# Altium schematic sheet JP-LED.SchDoc
size A4
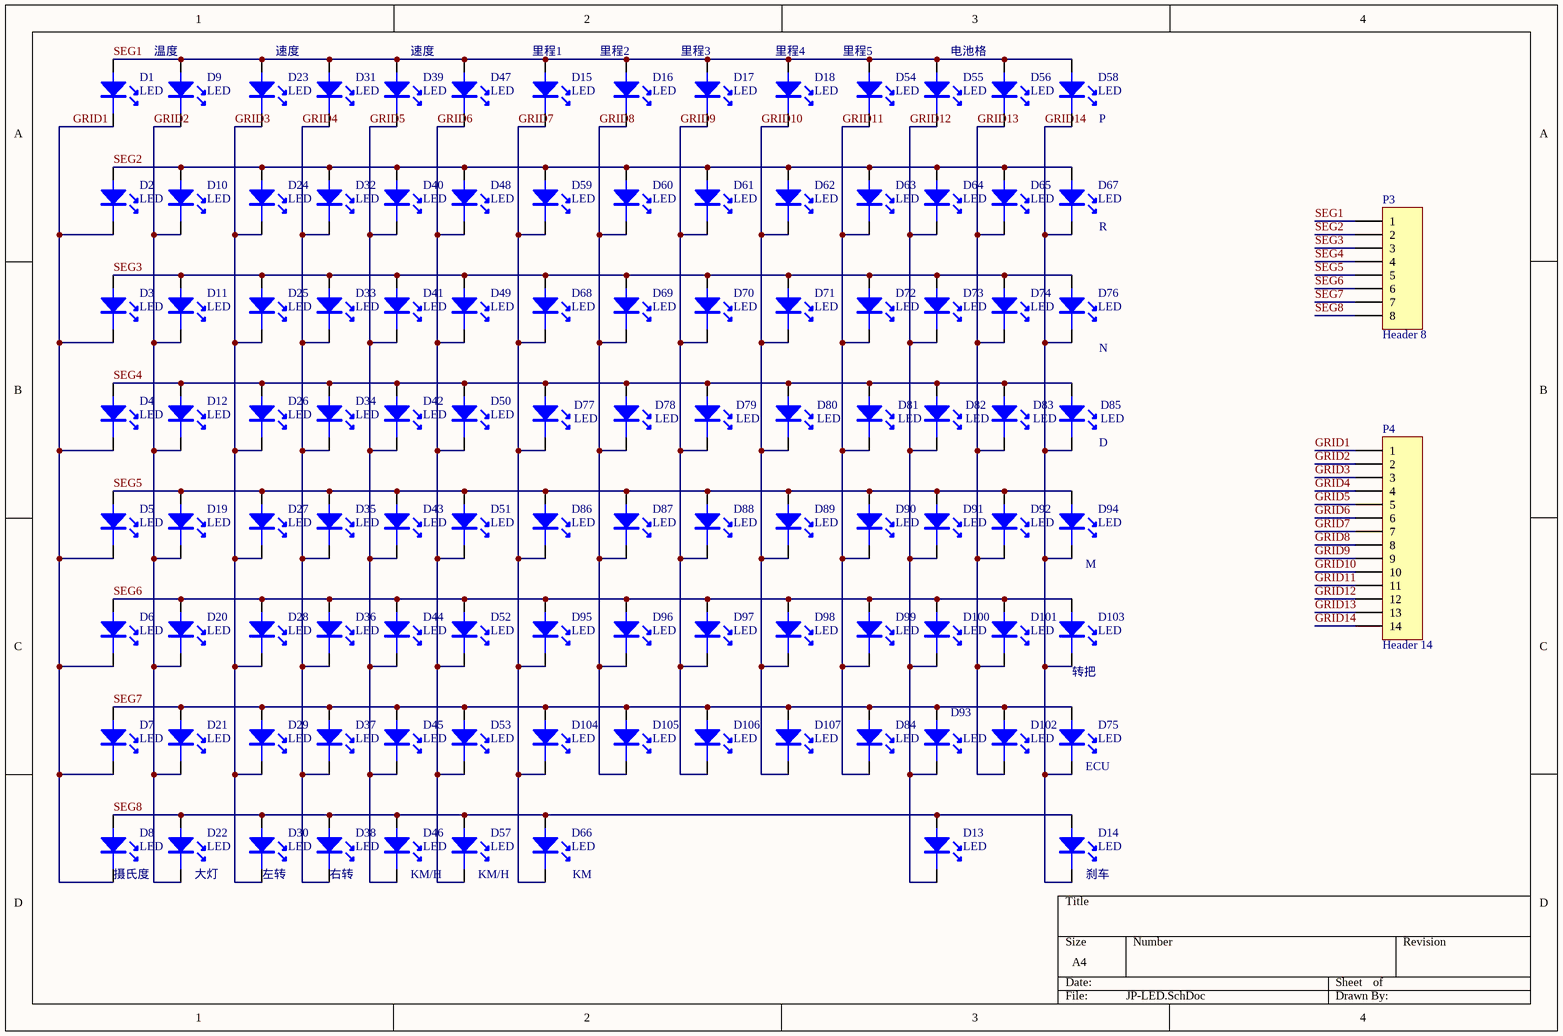
[diagram p0: JP-LED.SchDoc]

## Parts
D1  LED  [0603-LED]
D2  LED  [0603-LED]
D3  LED  [0603-LED]
D4  LED  [0603-LED]
D5  LED  [0603-LED]
D6  LED  [0603-LED]
D7  LED  [0603-LED]
D8  LED  [0603-LED]
D9  LED  [0603-LED]
D10  LED  [0603-LED]
D11  LED  [0603-LED]
D12  LED  [0603-LED]
D13  LED  [0603-LED]
D14  LED  [0603-LED]
D15  LED  [0603-LED]
D16  LED  [0603-LED]
D17  LED  [0603-LED]
D18  LED  [0603-LED]
D19  LED  [0603-LED]
D20  LED  [0603-LED]
D21  LED  [0603-LED]
D22  LED  [0603-LED]
D23  LED  [0603-LED]
D24  LED  [0603-LED]
D25  LED  [0603-LED]
D26  LED  [0603-LED]
D27  LED  [0603-LED]
D28  LED  [0603-LED]
D29  LED  [0603-LED]
D30  LED  [0603-LED]
D31  LED  [0603-LED]
D32  LED  [0603-LED]
D33  LED  [0603-LED]
D34  LED  [0603-LED]
D35  LED  [0603-LED]
D36  LED  [0603-LED]
D37  LED  [0603-LED]
D38  LED  [0603-LED]
D39  LED  [0603-LED]
D40  LED  [0603-LED]
D41  LED  [0603-LED]
D42  LED  [0603-LED]
D43  LED  [0603-LED]
D44  LED  [0603-LED]
D45  LED  [0603-LED]
D46  LED  [0603-LED]
D47  LED  [0603-LED]
D48  LED  [0603-LED]
D49  LED  [0603-LED]
D50  LED  [0603-LED]
D51  LED  [0603-LED]
D52  LED  [0603-LED]
D53  LED  [0603-LED]
D54  LED  [0603-LED]
D55  LED  [0603-LED]
D56  LED  [0603-LED]
D57  LED  [0603-LED]
D58  LED  [0603-LED]
D59  LED  [0603-LED]
D60  LED  [0603-LED]
D61  LED  [0603-LED]
D62  LED  [0603-LED]
D63  LED  [0603-LED]
D64  LED  [0603-LED]
D65  LED  [0603-LED]
D66  LED  [0603-LED]
D67  LED  [0603-LED]
D68  LED  [0603-LED]
D69  LED  [0603-LED]
D70  LED  [0603-LED]
D71  LED  [0603-LED]
D72  LED  [0603-LED]
D73  LED  [0603-LED]
D74  LED  [0603-LED]
D75  LED  [0603-LED]
D76  LED  [0603-LED]
D77  LED  [0603-LED]
D78  LED  [0603-LED]
D79  LED  [0603-LED]
D80  LED  [0603-LED]
D81  LED  [0603-LED]
D82  LED  [0603-LED]
D83  LED  [0603-LED]
D84  LED  [0603-LED]
D85  LED  [0603-LED]
D86  LED  [0603-LED]
D87  LED  [0603-LED]
D88  LED  [0603-LED]
D89  LED  [0603-LED]
D90  LED  [0603-LED]
D91  LED  [0603-LED]
D92  LED  [0603-LED]
D93  LED  [0603-LED]
D94  LED  [0603-LED]
D95  LED  [0603-LED]
D96  LED  [0603-LED]
D97  LED  [0603-LED]
D98  LED  [0603-LED]
D99  LED  [0603-LED]
D100  LED  [0603-LED]
D101  LED  [0603-LED]
D102  LED  [0603-LED]
D103  LED  [0603-LED]
D104  LED  [0603-LED]
D105  LED  [0603-LED]
D106  LED  [0603-LED]
D107  LED  [0603-LED]
P3  Header 8  [HDR1X8]
P4  Header 14  [SIP14]

## Nets
GRID1: D1.2 D2.2 D3.2 D4.2 D5.2 D6.2 D7.2 D8.2 P4.1
GRID2: D9.2 D10.2 D11.2 D12.2 D19.2 D20.2 D21.2 D22.2 P4.2
GRID3: D23.2 D24.2 D25.2 D26.2 D27.2 D28.2 D29.2 D30.2 P4.3
GRID4: D31.2 D32.2 D33.2 D34.2 D35.2 D36.2 D37.2 D38.2 P4.4
GRID5: D39.2 D40.2 D41.2 D42.2 D43.2 D44.2 D45.2 D46.2 P4.5
GRID6: D47.2 D48.2 D49.2 D50.2 D51.2 D52.2 D53.2 D57.2 P4.6
GRID7: D15.2 D59.2 D66.2 D68.2 D77.2 D86.2 D95.2 D104.2 P4.7
GRID8: D16.2 D60.2 D69.2 D78.2 D87.2 D96.2 D105.2 P4.8
GRID9: D17.2 D61.2 D70.2 D79.2 D88.2 D97.2 D106.2 P4.9
GRID10: D18.2 D62.2 D71.2 D80.2 D89.2 D98.2 D107.2 P4.10
GRID11: D54.2 D63.2 D72.2 D81.2 D84.2 D90.2 D99.2 P4.11
GRID12: D13.2 D55.2 D64.2 D73.2 D82.2 D91.2 D93.2 D100.2 P4.12
GRID13: D56.2 D65.2 D74.2 D83.2 D92.2 D101.2 D102.2 P4.13
GRID14: D14.2 D58.2 D67.2 D75.2 D76.2 D85.2 D94.2 D103.2 P4.14
SEG1: D1.1 D9.1 D15.1 D16.1 D17.1 D18.1 D23.1 D31.1 D39.1 D47.1 D54.1 D55.1 D56.1 D58.1 P3.1
SEG2: D2.1 D10.1 D24.1 D32.1 D40.1 D48.1 D59.1 D60.1 D61.1 D62.1 D63.1 D64.1 D65.1 D67.1 P3.2
SEG3: D3.1 D11.1 D25.1 D33.1 D41.1 D49.1 D68.1 D69.1 D70.1 D71.1 D72.1 D73.1 D74.1 D76.1 P3.3
SEG4: D4.1 D12.1 D26.1 D34.1 D42.1 D50.1 D77.1 D78.1 D79.1 D80.1 D81.1 D82.1 D83.1 D85.1 P3.4
SEG5: D5.1 D19.1 D27.1 D35.1 D43.1 D51.1 D86.1 D87.1 D88.1 D89.1 D90.1 D91.1 D92.1 D94.1 P3.5
SEG6: D6.1 D20.1 D28.1 D36.1 D44.1 D52.1 D95.1 D96.1 D97.1 D98.1 D99.1 D100.1 D101.1 D103.1 P3.6
SEG7: D7.1 D21.1 D29.1 D37.1 D45.1 D53.1 D75.1 D84.1 D93.1 D102.1 D104.1 D105.1 D106.1 D107.1 P3.7
SEG8: D8.1 D13.1 D14.1 D22.1 D30.1 D38.1 D46.1 D57.1 D66.1 P3.8

## Notes on the sheet
- (near D9) 温度
- (near D23) 速度
- (near D39) 速度
- (near D15) 里程1
- (near D16) 里程2
- (near D17) 里程3
- (near D18) 里程4
- (near D54) 里程5
- (near D55) 电池格
- (near D58) P
- (near D67) R
- N
- (near D85) D
- (near D94) M
- (near D103) 转把
- (near D75) ECU
- (near D8) 摄氏度
- (near D22) 大灯
- (near D30) 左转
- (near D38) 右转
- (near D46) KM/H
- (near D57) KM/H
- (near D66) KM
- (near D14) 刹车

## Library data of the parts
P3 = Header 8: Header, 8-Pin; LatestRevisionDate: 17-Jul-2002; LatestRevisionNote: Re-released for DXP Platform.; Publisher: Altium Limited
P4 = Header 14: Header, 14-Pin; LatestRevisionDate: 17-Jul-2002; LatestRevisionNote: Re-released for DXP Platform.; Publisher: Altium Limited